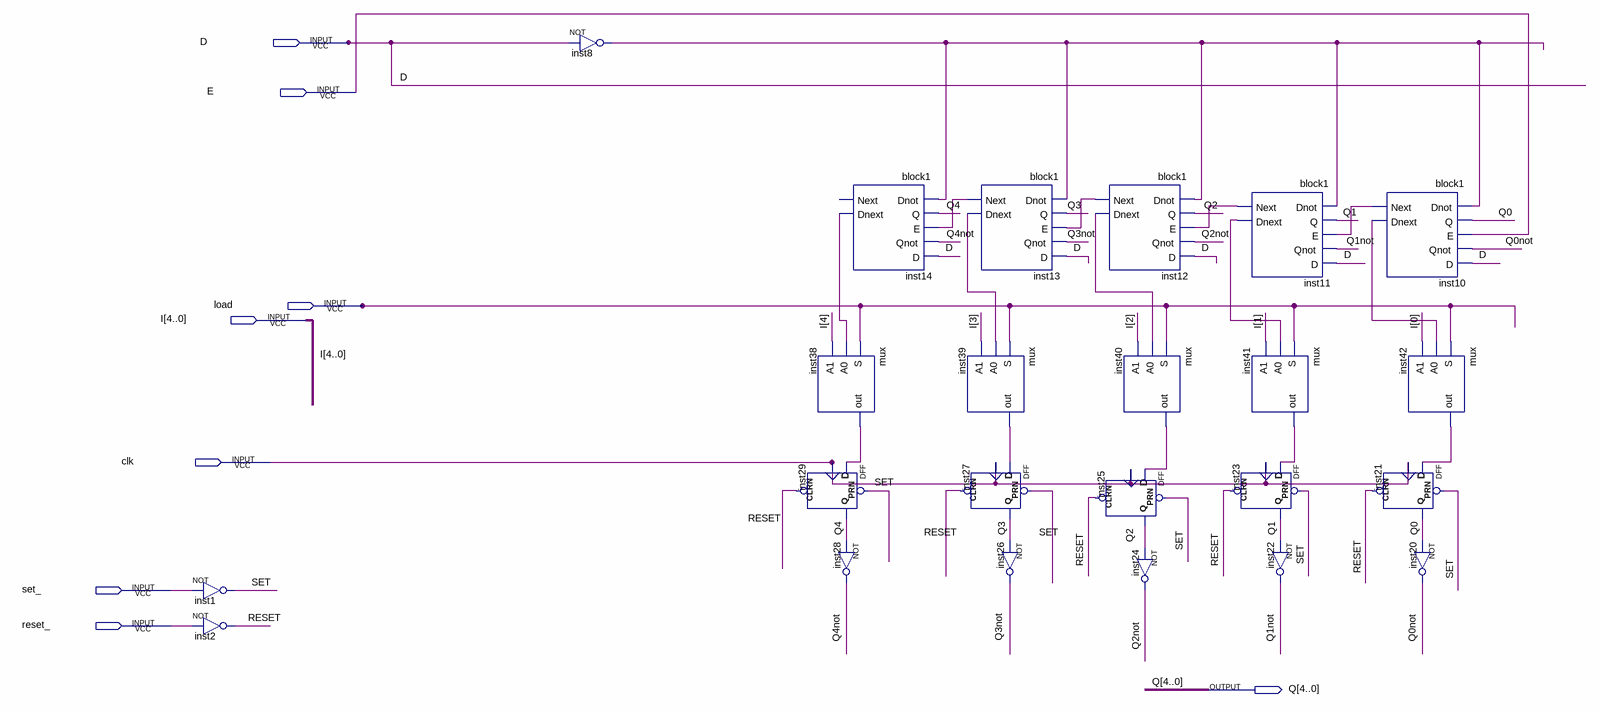
[diagram p0: schematic sheet]
// Quartus schematic block2.bdf as structural Verilog: 23 symbols, 8 pins
module block2 (
  input  D,
  input  E,
  input  load,
  input  [4:0] I,
  input  clk,
  input  set_,
  input  reset_,
  output [4:0] Q
);

  wire inst8_out, inst10_dnext, inst10_next, inst11_dnext, inst11_next, inst12_dnext, inst12_next,
       inst13_dnext, inst13_next, inst14_dnext, inst38_out, inst39_out, inst40_out, inst41_out, inst42_out,
       Q0not, Q1not, Q2not, Q3not, Q4not, RESET, SET;

  not inst1 (SET, set_);
  not inst2 (RESET, reset_);
  not inst8 (inst8_out, D);
  mux inst38 (.S(load), .A0(inst14_dnext), .A1(I[4]), .out(inst38_out));
  DFF inst29 (.CLRN(RESET), .CLK(clk), .D(inst38_out), .PRN(SET), .Q(Q[4]));
  not inst28 (Q4not, Q[4]);
  block1 inst14 (.Dnot(inst8_out), .Q(Q[4]), .E(inst13_next), .Qnot(Q4not), .D(D), .Dnext(inst14_dnext));  // open: Next
  block1 inst13 (
    .Dnot(inst8_out), .Q(Q[3]), .E(inst12_next), .Qnot(Q3not), .D(D), .Next(inst13_next), .Dnext(inst13_dnext));
  mux inst39 (.S(load), .A0(inst13_dnext), .A1(I[3]), .out(inst39_out));
  DFF inst27 (.CLRN(RESET), .CLK(clk), .D(inst39_out), .PRN(SET), .Q(Q[3]));
  not inst26 (Q3not, Q[3]);
  block1 inst12 (
    .Dnot(inst8_out), .Q(Q[2]), .E(inst11_next), .Qnot(Q2not), .D(D), .Next(inst12_next), .Dnext(inst12_dnext));
  mux inst40 (.S(load), .A0(inst12_dnext), .A1(I[2]), .out(inst40_out));
  DFF inst25 (.CLRN(RESET), .CLK(clk), .D(inst40_out), .PRN(SET), .Q(Q[2]));
  not inst24 (Q2not, Q[2]);
  DFF inst23 (.CLRN(RESET), .CLK(clk), .D(inst41_out), .PRN(SET), .Q(Q[1]));
  block1 inst11 (
    .Dnot(inst8_out), .Q(Q[1]), .E(inst10_next), .Qnot(Q1not), .D(D), .Next(inst11_next), .Dnext(inst11_dnext));
  mux inst41 (.S(load), .A0(inst11_dnext), .A1(I[1]), .out(inst41_out));
  not inst22 (Q1not, Q[1]);
  block1 inst10 (.Dnot(inst8_out), .Q(Q[0]), .E(E), .Qnot(Q0not), .D(D), .Next(inst10_next), .Dnext(inst10_dnext));
  mux inst42 (.S(load), .A0(inst10_dnext), .A1(I[0]), .out(inst42_out));
  DFF inst21 (.CLRN(RESET), .CLK(clk), .D(inst42_out), .PRN(SET), .Q(Q[0]));
  not inst20 (Q0not, Q[0]);
endmodule
